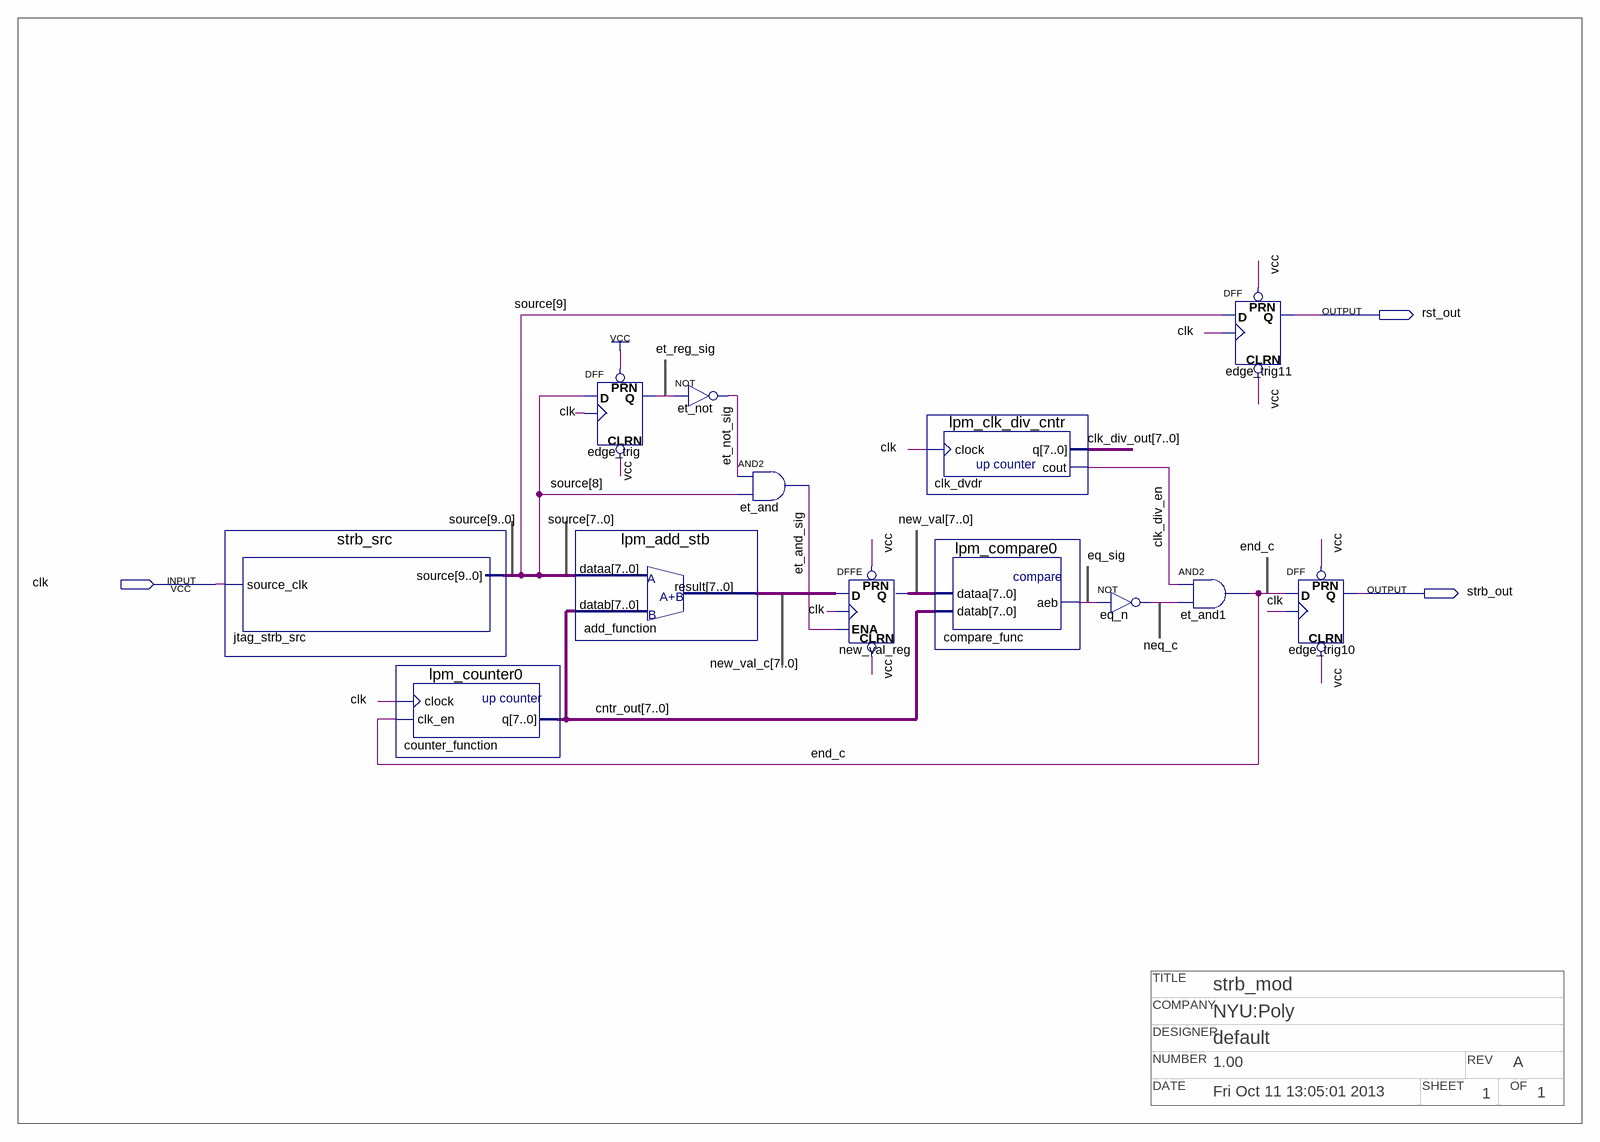
[diagram p0: schematic sheet]
// Quartus schematic strb_mod.bdf as structural Verilog: 13 symbols, 3 pins
// Title block: COMPANY: NYU:Poly; DATE: Fri Oct 11 13:05:01 2013; DESIGNER: default; NUMBER: 1.00; OF: 1; REV: A; SHEET: 1; TITLE: strb_mod
module strb_mod (
  input  clk,
  output rst_out,
  output strb_out
);

  wire clk_div_en, end_c, eq_sig, et_and_sig, et_not_sig, et_reg_sig, neq_c;
  wire [7:0] clk_div_out, cntr_out, new_val, new_val_c;
  wire [9:0] source;

  strb_src jtag_strb_src (.source_clk(clk), .source(source));
  lpm_counter0 counter_function (.clock(clk), .clk_en(end_c), .q(cntr_out));
  DFF edge_trig (.CLRN(1'b1), .CLK(clk), .D(source[8]), .PRN(1'b1), .Q(et_reg_sig));
  lpm_add_stb add_function (.dataa(source[7:0]), .datab(cntr_out), .result(new_val_c));
  not et_not (et_not_sig, et_reg_sig);
  and et_and (et_and_sig, et_not_sig, source[8]);
  DFFE new_val_reg[7:0] (.PRN(1'b1), .CLRN(1'b1), .D(new_val_c), .CLK(clk), .ENA(et_and_sig), .Q(new_val));
  lpm_clk_div_cntr clk_dvdr (.clock(clk), .cout(clk_div_en), .q(clk_div_out));
  lpm_compare0 compare_func (.dataa(new_val), .datab(cntr_out), .aeb(eq_sig));
  not eq_n (neq_c, eq_sig);
  and et_and1 (end_c, clk_div_en, neq_c);
  DFF edge_trig11 (.CLRN(1'b1), .CLK(clk), .D(source[9]), .PRN(1'b1), .Q(rst_out));
  DFF edge_trig10 (.CLRN(1'b1), .CLK(clk), .D(end_c), .PRN(1'b1), .Q(strb_out));
endmodule
